# Altium schematic sheet Digital Port F.SchDoc: Port F Digital Control
size A4
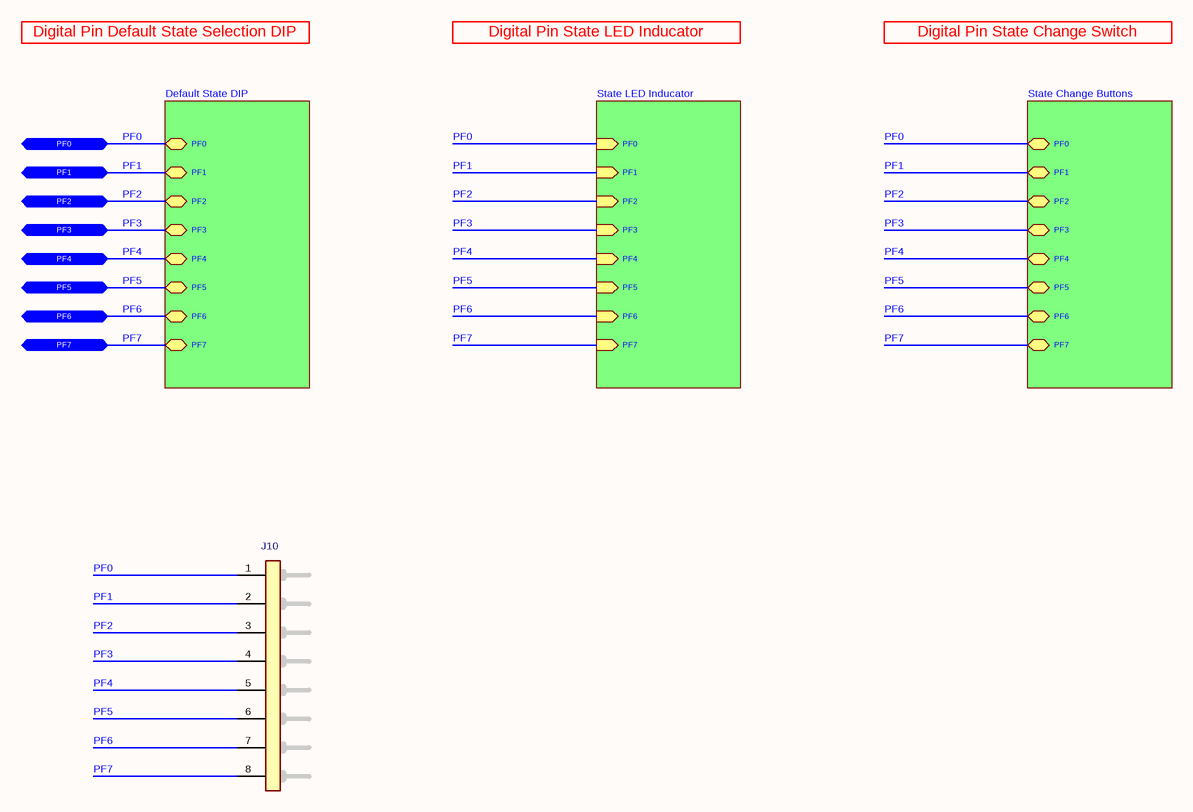
[diagram p0: Digital Port F.SchDoc]

## Parts
J10  2.54 mm Pitch 8P Male Connector  [8P Header]  (value not drawn)

## Sub-sheets
Default State DIP = Digital Port F Default State DIP.SchDoc: PF1 (bidir), PF0 (bidir), PF7 (bidir), PF4 (bidir), PF6 (bidir), PF3 (bidir), PF5 (bidir), PF2 (bidir)
State Change Buttons = Digital Port F Button.SchDoc: PF1 (bidir), PF0 (bidir), PF7 (bidir), PF4 (bidir), PF6 (bidir), PF3 (bidir), PF5 (bidir), PF2 (bidir)
State LED Inducator = Digital Port F State LED Inducator.SchDoc: PF1 (in), PF0 (in), PF7 (in), PF4 (in), PF6 (in), PF3 (in), PF5 (in), PF2 (in)

## Ports
PF0 (bidir), PF1 (bidir), PF2 (bidir), PF3 (bidir), PF4 (bidir), PF5 (bidir), PF6 (bidir), PF7 (bidir)

## Nets
PF0: J10.1(Pin-1) ; port PF0, sheet Default State DIP/PF0, sheet State LED Inducator/PF0, sheet State Change Buttons/PF0
PF1: J10.2(Pin-2) ; port PF1, sheet Default State DIP/PF1, sheet State LED Inducator/PF1, sheet State Change Buttons/PF1
PF2: J10.3(Pin-3) ; port PF2, sheet Default State DIP/PF2, sheet State LED Inducator/PF2, sheet State Change Buttons/PF2
PF3: J10.4(Pin-4) ; port PF3, sheet Default State DIP/PF3, sheet State LED Inducator/PF3, sheet State Change Buttons/PF3
PF4: J10.5(Pin-5) ; port PF4, sheet Default State DIP/PF4, sheet State LED Inducator/PF4, sheet State Change Buttons/PF4
PF5: J10.6(Pin-6) ; port PF5, sheet Default State DIP/PF5, sheet State LED Inducator/PF5, sheet State Change Buttons/PF5
PF6: J10.7(Pin-7) ; port PF6, sheet Default State DIP/PF6, sheet State LED Inducator/PF6, sheet State Change Buttons/PF6
PF7: J10.8(Pin-8) ; port PF7, sheet Default State DIP/PF7, sheet State LED Inducator/PF7, sheet State Change Buttons/PF7

## Notes on the sheet
- Digital Pin Default State Selection DIP
- Digital Pin State LED Inducator
- Digital Pin State Change Switch
- Title
- Size:
- Date:
- A4
- Number:
- Time:
- Revision:
- Sheet
- of
- File:

## Library data of the parts
J10 = Connector - Male Header 8P (2.54): Headers & Wire Housings BREAKAWAY HDR VERT 8; Manufacturer Name: Molex; Position: 8; Row: 1; Pitch: 2.54 mm; Manufacturer Part Number: 22-28-4083; Mouser Part Number: 538-22-28-4083; ROHS: Yes; ComponentLink1Description: DataSheet; ComponentLink1URL: https://www.mouser.com.tr/datasheet/2/276/0022284063_PCB_HEADERS-228265.pdf; ComponentLink2Description: Mouser; ComponentLink2URL: https://www.mouser.com.tr/ProductDetail/Molex/22-28-4083/?qs=%2Fha2pyFaduguMWEp6M%252Bj0x6fHxUvnRGD%252BIxBoa6MO5w%3D